# Altium schematic sheet POWER.SchDoc
size 420 x 297 mm; SheetNumber: 3; SheetTotal: 6
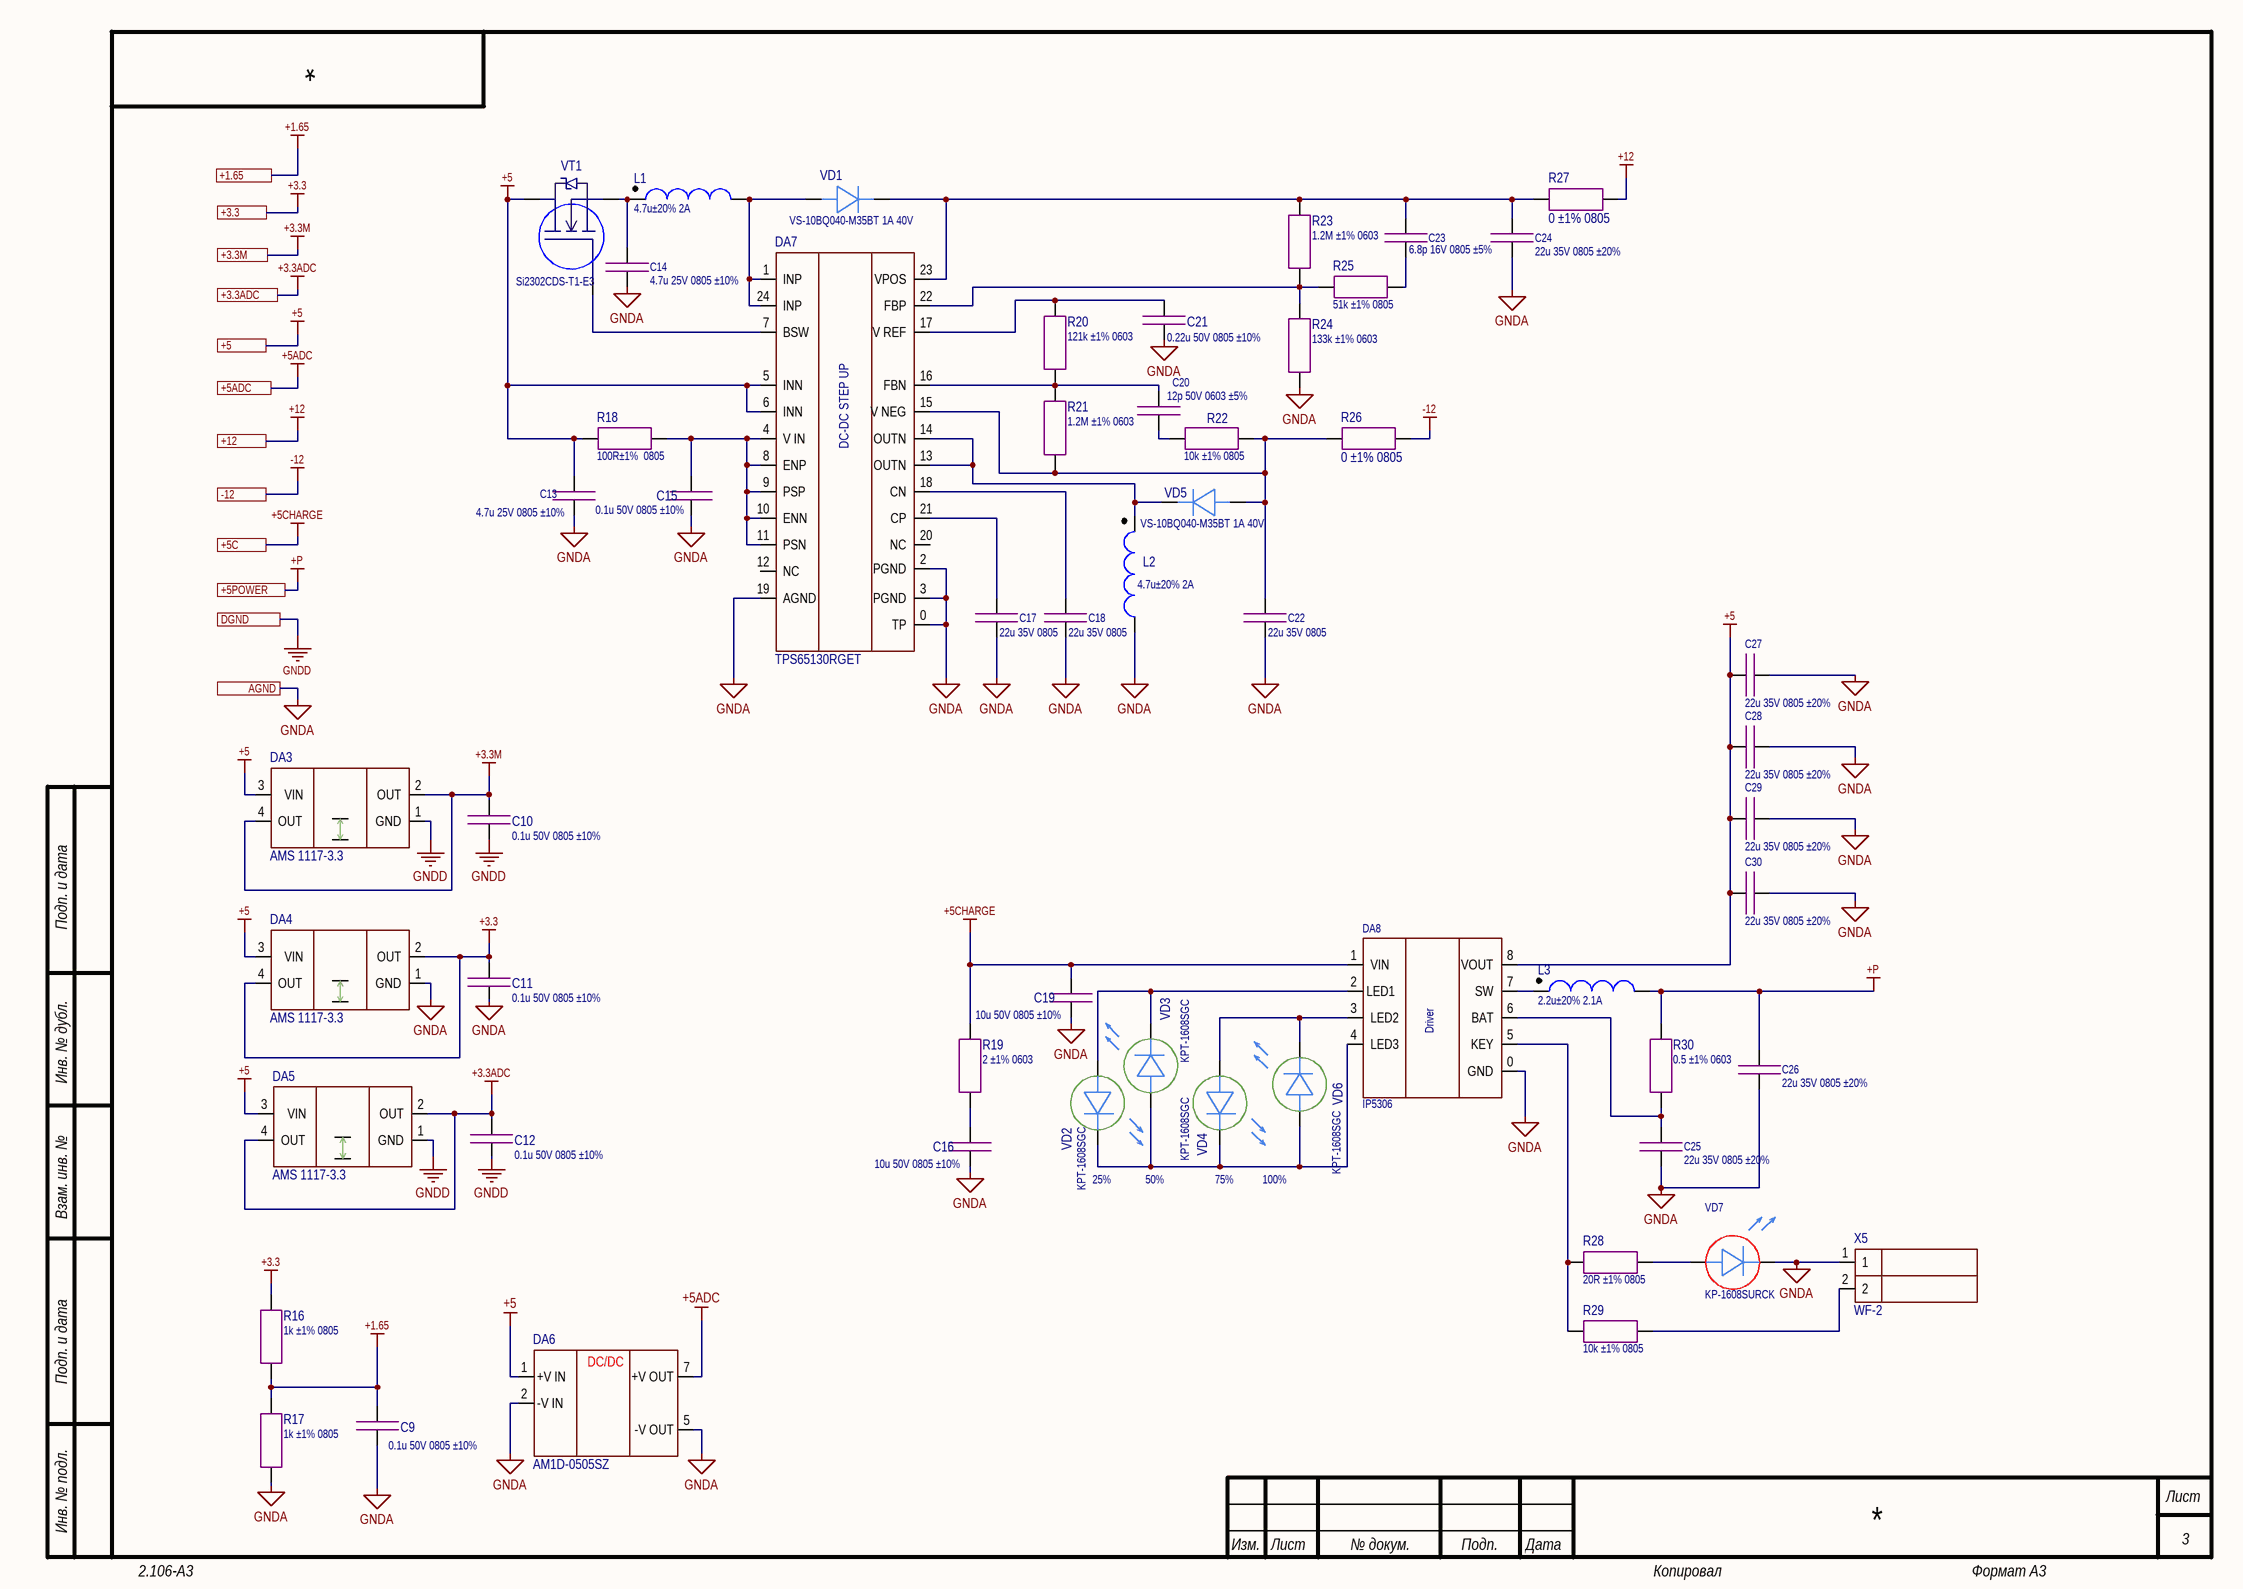
[diagram p0: POWER.SchDoc]

## Parts
C9  0.1u 50V 0805 ±10%  [CAP: SMD 0805 MD IPC 782]
C10  0.1u 50V 0805 ±10%  [CAP: SMD 0805 MD IPC 782]
C11  0.1u 50V 0805 ±10%  [CAP: SMD 0805 MD IPC 782]
C12  0.1u 50V 0805 ±10%  [CAP: SMD 0805 MD IPC 782]
C13  4.7u 25V 0805 ±10%  [CAP: SMD 0805 MD IPC 782]
C14  4.7u 25V 0805 ±10%  [CAP: SMD 0805 MD IPC 782]
C15  0.1u 50V 0805 ±10%  [CAP: SMD 0805 MD IPC 782]
C16  10u 50V 0805 ±10%  [CAP: SMD 0805 MD IPC 782]
C17  22u 35V 0805  [CAP: SMD 0805 MD IPC 782]
C18  22u 35V 0805  [CAP: SMD 0805 MD IPC 782]
C19  10u 50V 0805 ±10%  [CAP: SMD 0805 MD IPC 782]
C20  12p 50V 0603 ±5%  [CAP: SMD 0603 MD IPC 782]
C21  0.22u 50V 0805 ±10%  [CAP: SMD 0805 MD IPC 782]
C22  22u 35V 0805  [CAP: SMD 0805 MD IPC 782]
C23  6.8p 16V 0805 ±5%  [CAP: SMD 0805 MD IPC 782]
C24  22u 35V 0805 ±20%  [CAP: SMD 0805 MD IPC 782]
C25  22u 35V 0805 ±20%  [CAP: SMD 0805 MD IPC 782]
C26  22u 35V 0805 ±20%  [CAP: SMD 0805 MD IPC 782]
C27  22u 35V 0805 ±20%  [CAP: SMD 0805 MD IPC 782]
C28  22u 35V 0805 ±20%  [CAP: SMD 0805 MD IPC 782]
C29  22u 35V 0805 ±20%  [CAP: SMD 0805 MD IPC 782]
C30  22u 35V 0805 ±20%  [CAP: SMD 0805 MD IPC 782]
DA3  AMS 1117-3.3  [IC: SOT 223]
DA4  AMS 1117-3.3  [IC: SOT 223]
DA5  AMS 1117-3.3  [IC: SOT 223]
DA6  AM1D-0505SZ  [AM1D]
DA7  TPS65130RGET  [IC: PVQFN 24]
DA8  IP5306  [IC: SOIC 8 TP]
L1  4.7u±20% 2A  [IND: LPS5030]
L2  4.7u±20% 2A  [IND: LPS5030]
L3  2.2u±20% 2.1A  [IND: LPS3015]
R16  1k ±1% 0805  [RES: SMD 0805 MD IPC 782]
R17  1k ±1% 0805  [RES: SMD 0805 MD IPC 782]
R18  100R±1%  0805  [RES: SMD 0805 MD IPC 782]
R19  2 ±1% 0603  [RES: SMD 0603 MD IPC 782]
R20  121k ±1% 0603  [RES: SMD 0603 MD IPC 782]
R21  1.2M ±1% 0603  [RES: SMD 0603 MD IPC 782]
R22  10k ±1% 0805  [RES: SMD 0805 MD IPC 782]
R23  1.2M ±1% 0603  [RES: SMD 0603 MD IPC 782]
R24  133k ±1% 0603  [RES: SMD 0603 MD IPC 782]
R25  51k ±1% 0805  [RES: SMD 0805 MD IPC 782]
R26  0 ±1% 0805  [RES: SMD 0805 MD IPC 782]
R27  0 ±1% 0805  [RES: SMD 0805 MD IPC 782]
R28  20R ±1% 0805  [RES: SMD 0805 MD IPC 782]
R29  10k ±1% 0805  [RES: SMD 0805 MD IPC 782]
R30  0.5 ±1% 0603  [RES: SMD 0603 MD IPC 782]
VD1  VS-10BQ040-M35BT 1A 40V  [DIODE: SMB]
VD2  KPT-1608SGC  [DIODE: LED 0603(1608) green]
VD3  KPT-1608SGC  [DIODE: LED 0603(1608) green]
VD4  KPT-1608SGC  [DIODE: LED 0603(1608) green]
VD5  VS-10BQ040-M35BT 1A 40V  [DIODE: SMB]
VD6  KPT-1608SGC  [DIODE: LED 0603(1608) green]
VD7  KP-1608SURCK  [DIODE: LED 0603(1608) red]
VT1  Si2302CDS-T1-E3  [IC: SOT 23]
X5  WF-2  [CON: 2pin wf-2]

## Ports
+1.65 (see REO_ECG[3C], ECG[4A], Generator_REO[1A]), +3.3 (see REO_ECG[3C], ECG[4A], INTERFACES[4A]), +3.3ADC (see REO_ECG[3C], INTERFACES[4A]), +3.3M (see REO_ECG[3C], INTERFACES[4A]), +5 (see REO_ECG[2C]), +5ADC (see REO_ECG[2C], INTERFACES[4A]), +5C (see REO_ECG[2C]), +5POWER (see REO_ECG[3C]), +12 (see REO_ECG[3C], ECG[4A], Generator_REO[1A], INTERFACES[4A], Measurement_REO[4A]), -12 (see REO_ECG[3C], ECG[4A], Generator_REO[1B], INTERFACES[4A], Measurement_REO[4A]), AGND (see REO_ECG[2C], ECG[4B], Generator_REO[1B], Measurement_REO[4A]), DGND (see REO_ECG[2C], Generator_REO[1C])

## Nets
+1.65: C9.1 R16.1 R17.2 ; port +1.65
+3.3: C11.1 DA4.2(OUT) DA4.4(OUT) R16.2 ; port +3.3
+3.3ADC: C12.1 DA5.2(OUT) DA5.4(OUT) ; port +3.3ADC
+3.3M: C10.1 DA3.2(OUT) DA3.4(OUT) ; port +3.3M
+5: C13.1 C27.1 C28.1 C29.1 C30.1 DA3.3(VIN) DA4.3(VIN) DA5.3(VIN) DA6.1(+V_IN) DA7.5(INN) DA7.6(INN) DA8.8(VOUT) R18.1 VT1.3 ; port +5
+5ADC: DA6.7(+V_OUT) ; port +5ADC
+5CHARGE: C19.1 DA8.1(VIN) R19.2 ; port +5C
+12: R27.2 ; port +12
+P: C26.1 L3.2 R30.2 ; port +5POWER
-12: R26.2 ; port -12
GNDA: C9.2 C11.2 C13.2 C14.2 C15.2 C16.2 C17.2 C18.2 C19.2 C21.2 C22.2 C24.2 C25.2 C26.2 C27.2 C28.2 C29.2 C30.2 DA4.1(GND) DA6.2(-V_IN) DA6.5(-V_OUT) DA7.0(TP) DA7.2(PGND) DA7.3(PGND) DA7.19(AGND) DA8.0(GND) L2.2 R17.1 R24.1 VD7.1 X5.1 ; port AGND
GNDD: C10.2 C12.2 DA3.1(GND) DA5.1(GND) ; port DGND
NetC14_1: C14.1 L1.1 VT1.2
NetC15_1: C15.1 DA7.4(V_IN) DA7.8(ENP) DA7.9(PSP) DA7.10(ENN) DA7.11(PSN) R18.2
NetC16_1: C16.1 R19.1
NetC17_1: C17.1 DA7.21(CP)
NetC18_1: C18.1 DA7.18(CN)
NetC20_1: C20.1 DA7.16(FBN) R20.1 R21.2
NetC20_2: C20.2 R22.1
NetC21_1: C21.1 DA7.17(V_REF) R20.2
NetC22_1: C22.1 DA7.15(V_NEG) R21.1 R22.2 R26.1 VD5.2
NetC23_1: C23.1 C24.1 DA7.23(VPOS) R23.2 R27.1 VD1.1
NetC23_2: C23.2 R25.2
NetC25_1: C25.1 DA8.6(BAT) R30.1
NetDA7_1: DA7.1(INP) DA7.24(INP) L1.2 VD1.2
NetDA7_7: DA7.7(BSW) VT1.1
NetDA7_13: DA7.13(OUTN) DA7.14(OUTN) L2.1 VD5.1
NetDA7_22: DA7.22(FBP) R23.1 R24.2 R25.1
NetDA8_2: DA8.2(LED1) VD2.2 VD3.1
NetDA8_3: DA8.3(LED2) VD4.2 VD6.1
NetDA8_4: DA8.4(LED3) VD2.1 VD3.2 VD4.1 VD6.2
NetDA8_5: DA8.5(KEY) R28.1 R29.1
NetDA8_7: DA8.7(SW) L3.1
NetR28_2: R28.2 VD7.2
NetR29_2: R29.2 X5.2

Not connected (* = marked no-connect by the designer): DA7 12(NC) 20(NC)

## Notes on the sheet
- (near VD2) 25%
- 50%
- (near VD4) 75%
- 100%
- Подп. и дата
- Инв. № дубл.
- Взам. инв. №
- Инв. № подл.
- Изм.
- Лист
- № докум.
- Подп.
- Дата
- 2.106-A3
- Копировал
- Формат А3
- (in symbol DC-DC: 3-15/-15V TPS65130RGET) DC-DC STEP UP
- (in symbol DC-DC: 5-5V AM1D-0505SZ) DC/DC
- (in symbol IP5306) Driver

## Library data of the parts
C9-C12 C15 = 0.1u 50V 0805 ±10%: Code: 6279254871; Name: Конденсатор X7R 50V 0,1uF ±10% 0805
C13 C14 = 4.7u 25V 0805 ±10%: Code: 6270000501; Name: Конденсатор X7R 25V 4,7uF±10% 0805
C16 C19 = 10u 50V 0805 ±10%: Code: 6289735441; Name: Конденсатор 12065D106KAT2A, AVX
C17 C18 C22 C24-C30 = 22u 35V 0805 ±20%: Code: 6279375691; Name: Конденсатор X5R 35V 22uF±20% 0805
C20 = 12p 50V 0603 ±5%: Code: 6279238291; Name: Конденсатор NP0 50V 12pF±5% 0603
C21 = 0.22u 50V 0805 ±10%: Name: Конденсатор 0805B224K500NT, Fenghua
C23 = 6.8p 50V 0805 ±5%: Code: 6219233221; Name: Конденсатор COG 16V 6.8pF±5% 0805
DA3-DA5 = LDO: 15-3.3V AMS1117: Code: 6339112951; Name: Микросхема AMS-1117-3.3
DA6 = DC-DC: 5-5V AM1D-0505SZ: Name: Микросхема AM1D-0505SZ, AIMTEC
DA7 = DC-DC: 3-15/-15V TPS65130RGET: Code: 6339113561; Name: Микросхема TPS65130RGET, TI
L1 L2 = 4.7u±20% 2A: LPS5030; Code: 6339119781; Name: Микросхема LPS5030-472MR(B), Coilcraft
L3 = 2.2u±20% 2.1A: LPS3015; Code: 6319247691; Name: Дроссель LPS3015-222MRC, Coilcraft
R16 R17 = 1k ±1% 0805: Code: 6027158691; Name: Резистор RC0805FR-071KL, Yageo
R18 = 100 ±1%  0805: Code: 6094351171; Name: Резистор 100R±1%  0805
R19 = 2 ±1% 0603: Code: 6069180891; Name: Резистор 2,2k ±1% 0603
R20 = 121k ±1% 0603: Code: 6060001691; Name: Резистор 121K±1% 0603
R21 R23 = 1.2M ±1% 0603: Code: 6069194591; Name: Резистор 1,2M±1% ТК50 0603
R22 R29 = 10k ±1% 0805: Code: 6020003061; Name: Резистор RC0805JR-0710KL
R24 = 133k ±1% 0603: Code: 6027155891; Name: Резистор CRCW0603133KFKEA, Vishay
R25 = 51k ±1% 0805: Code: 6094354057; Name: Резистор 51K±1% 0805
R26 R27 = 0 ±1% 0805: Code: 6094342239; Name: Резистор 0R ±1% 0805
R28 = 20R ±1% 0805: Code: 6094357581; Name: 20R ±1% 0805
R30 = 0.5 ±1% 0603: Name: Резистор 0.5 ±1% 0603
VD1 VD5 = Rectifier 1A 40V: Code: 6349982351; Name: Диод VS-10BQ040-M35BT, Vishay
VD2-VD4 VD6 = LED green 0603: Code: 6340003921; Name: Светодиод KPT-1608SGC, Kingbright
VD7 = LED red 0603: Code: 6349551609; Name: Светодиод KP-1608SURCK
VT1 = MOS N Si2302CDS-T1-E3: Code: 6349982201; Name: Транзистор Si2302CDS-T1-E3,  Vishay
X5 = 2 pin WF-2: Code: 6313952902; Name: Вилка WF-2